# EAGLE design fb_in8_24VDC_3.2 (EAGLE 5.00)
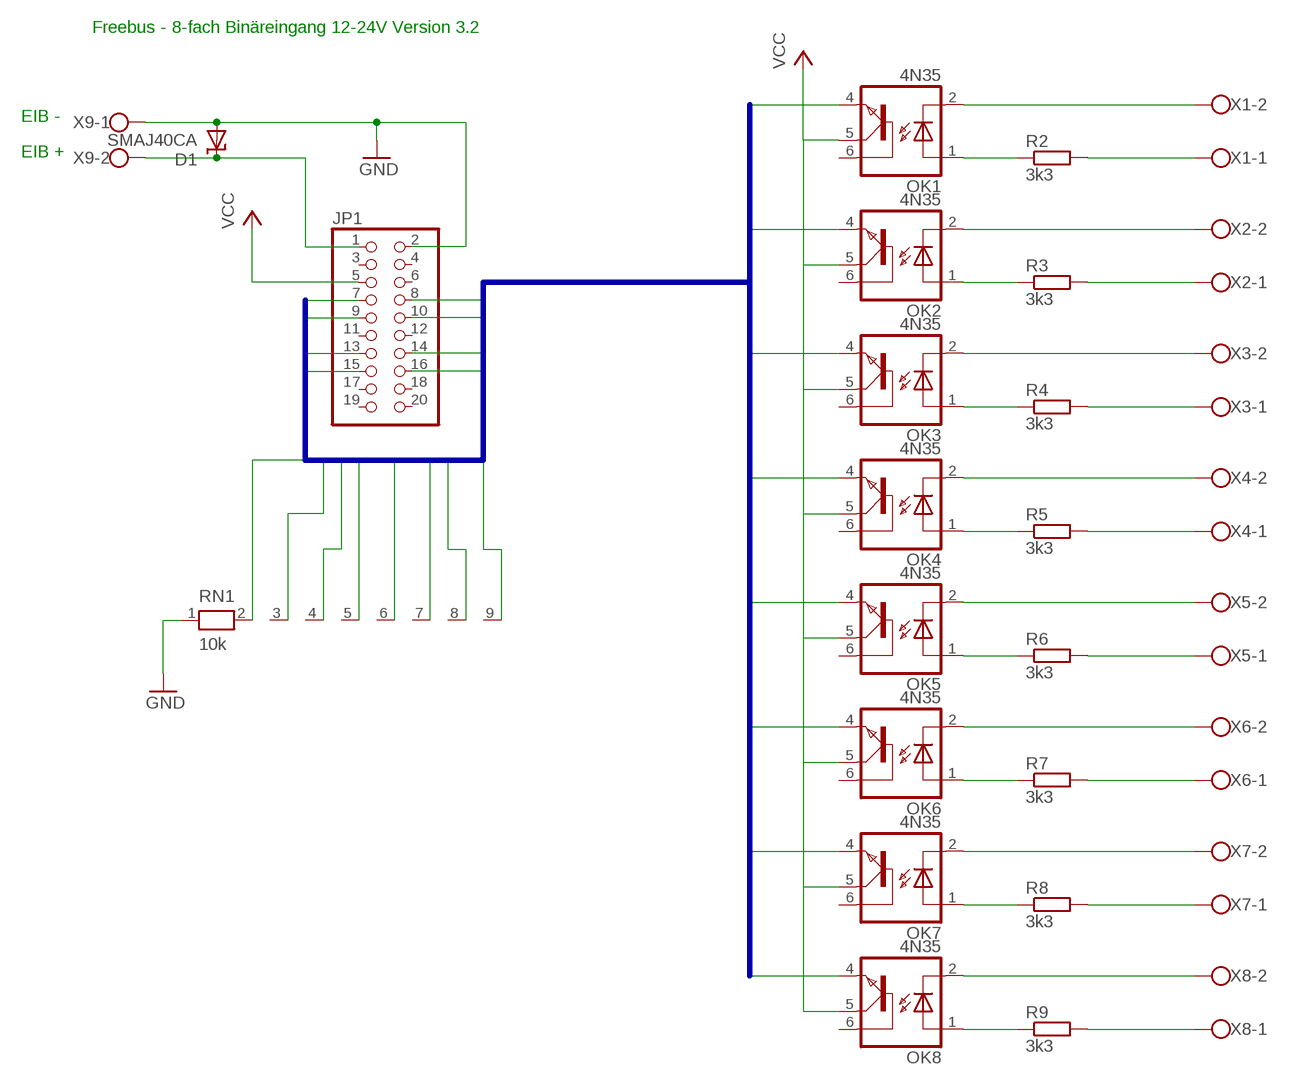
[diagram p0: schematic, sheet 1]

## Parts
D1  SMAJ40CA  SUPPRESSOR-SMBJ  [SMBJ]
JP1  PINHD-2X10  [2X10]
OK1  4N35  [DIL06]
OK2  4N35  [DIL06]
OK3  4N35  [DIL06]
OK4  4N35  [DIL06]
OK5  4N35  [DIL06]
OK6  4N35  [DIL06]
OK7  4N35  [DIL06]
OK8  4N35  [DIL06]
R2  3k3  R-EU_0207/10  [0207/10]
R3  3k3  R-EU_0207/10  [0207/10]
R4  3k3  R-EU_0207/10  [0207/10]
R5  3k3  R-EU_0207/10  [0207/10]
R6  3k3  R-EU_0207/10  [0207/10]
R7  3k3  R-EU_0207/10  [0207/10]
R8  3k3  R-EU_0207/10  [0207/10]
R9  3k3  R-EU_0207/10  [0207/10]
RN1  10k  RN08  [RN-9]
X1  W237-02P  [W237-132]
X2  W237-02P  [W237-132]
X3  W237-02P  [W237-132]
X4  W237-02P  [W237-132]
X5  W237-02P  [W237-132]
X6  W237-02P  [W237-132]
X7  W237-02P  [W237-132]
X8  W237-02P  [W237-132]
X9  W237-102  [W237-102]

## Nets
GND: D1.A JP1.2 RN1.1 X9.1
IO1: JP1.7 OK1.4(EMI) RN1.9
IO2: JP1.8 OK2.4(EMI) RN1.8
IO3: JP1.9 OK3.4(EMI) RN1.7
IO4: JP1.10 OK4.4(EMI) RN1.6
IO5: JP1.13 OK5.4(EMI) RN1.5
IO6: JP1.14 OK6.4(EMI) RN1.4
IO7: JP1.15 OK7.4(EMI) RN1.3
IO8: JP1.16 OK8.4(EMI) RN1.2
N$1: R8.2 X7.1
N$5: D1.C JP1.1 X9.2
N$25: OK2.2(C) X2.2
N$26: OK1.1(A) R2.1
N$27: OK2.1(A) R3.1
N$28: OK3.1(A) R4.1
N$29: OK4.1(A) R5.1
N$30: OK5.1(A) R6.1
N$31: OK6.1(A) R7.1
N$32: OK7.1(A) R8.1
N$33: OK8.1(A) R9.1
N$34: R3.2 X2.1
N$35: OK3.2(C) X3.2
N$36: R4.2 X3.1
N$37: OK4.2(C) X4.2
N$38: R5.2 X4.1
N$39: OK5.2(C) X5.2
N$40: R6.2 X5.1
N$41: OK1.2(C) X1.2
N$42: OK6.2(C) X6.2
N$43: R7.2 X6.1
N$44: OK7.2(C) X7.2
N$46: OK8.2(C) X8.2
N$47: R9.2 X8.1
N$48: R2.2 X1.1
VCC: JP1.5 OK1.5(COL) OK2.5(COL) OK3.5(COL) OK4.5(COL) OK5.5(COL) OK6.5(COL) OK7.5(COL) OK8.5(COL)
Unconnected: JP1.3 JP1.4 JP1.6 JP1.11 JP1.12 JP1.17 JP1.18 JP1.19 JP1.20 OK1.6(BAS) OK2.6(BAS) OK3.6(BAS) OK4.6(BAS) OK5.6(BAS) OK6.6(BAS) OK7.6(BAS) OK8.6(BAS)

## Buses
IO[1..8]

## Notes on the sheet
- Freebus - 8-fach Binäreingang 12-24V Version 3.2
- EIB -
- EIB +

## Library data of the parts
D1 = diode:SUPPRESSOR-: Suppressor diode
JP1 = pinhead:PINHD-2X10: PIN HEADER
OK1-OK8 = optocoupler:4N35: MOTOROLA OPTO COUPLER
R2-R9 = rcl:R-EU_: RESISTOR, European symbol
RN1 = resistor-net:RN08: RESISTOR NETWORK
X1-X8 = con-wago-508:W237-02P: WAGO SREW CLAMP
X9 = con-wago-500:W237-102: WAGO SCREW CLAMP

## Board
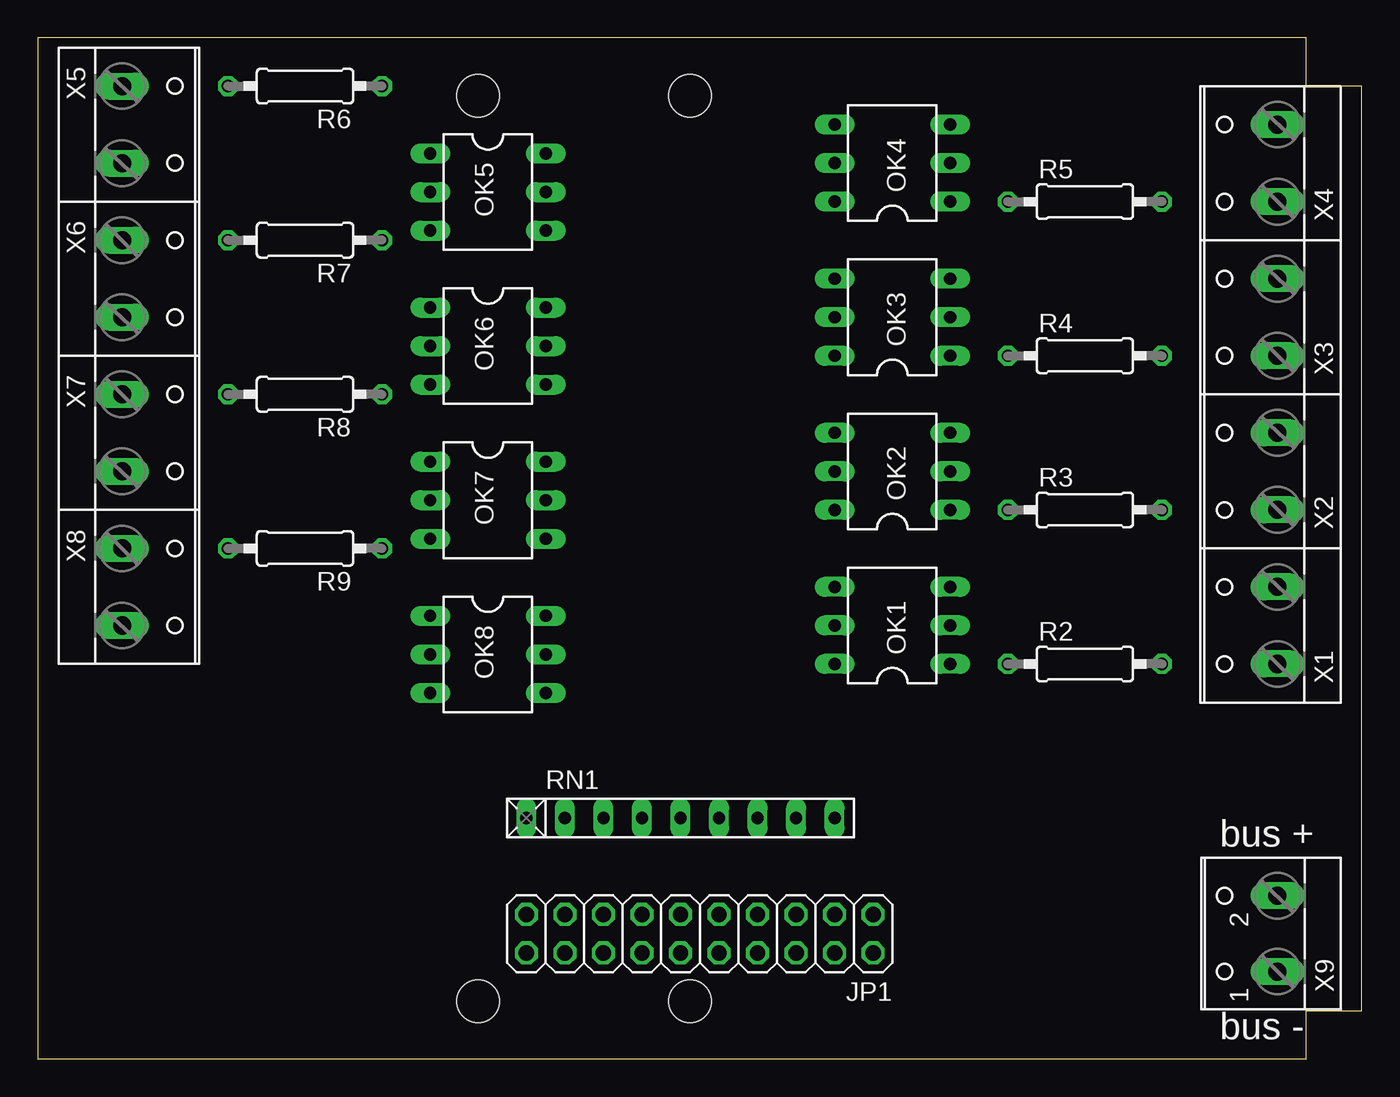
[diagram p1: board, top side]
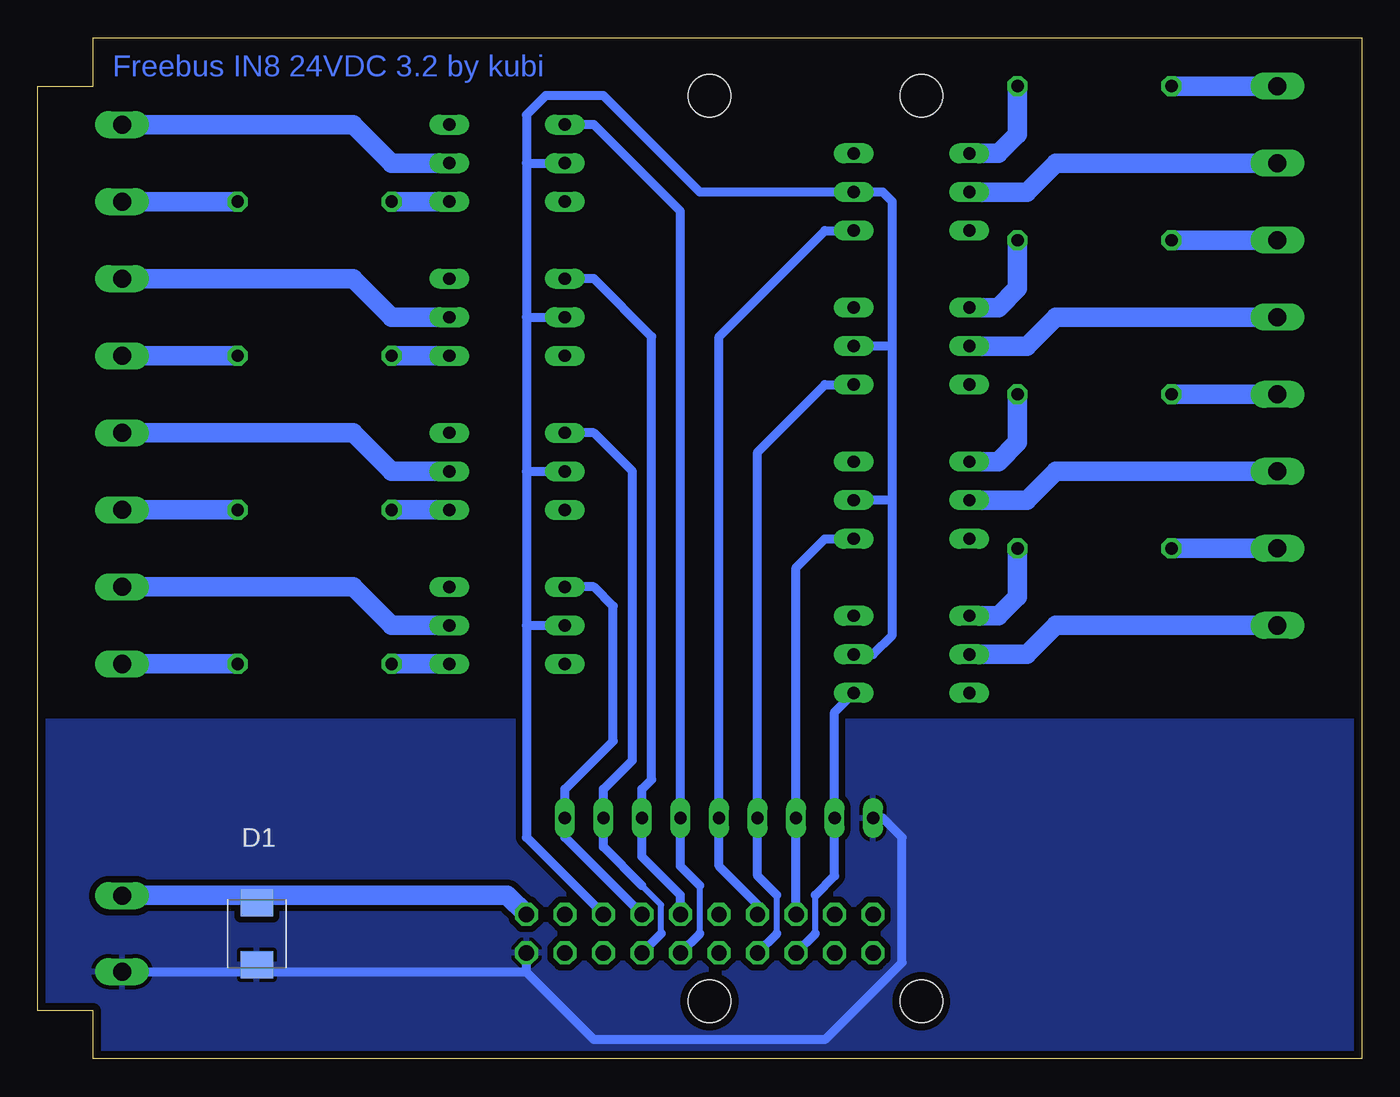
[diagram p2: board, bottom side, seen from below]

Size 87.3 x 67.31 mm. Coordinates in mm from the lower left corner, seen from the top.
Outline: 0,0.01 83.66,0 83.66,3.18 87.3,3.18 87.3,64.13 83.66,64.13 83.66,67.31 0,67.31 0,0.01
Copper layers (1*16): Top 0.035mm / dielectric 1.5mm / Bottom 0.035mm
Design rules "default *": minimum track width 10mil, minimum drill 24mil, track to track 16mil, track to pad 16mil, pad to pad 16mil, via to via 16mil, smd to smd 16mil, copper to edge 20mil, drill to drill 10mil, minimum pad ring 10mil, minimum via ring 8mil, stop-mask expansion 4mil, vias tented up to drill 0mil, thermal gap 10mil
Holes 2.8 mm at 43.02,63.5 29.04,3.81 29.04,63.5 43.02,3.81

### Footprints (pad centres in the part's own frame; a part is rotated, then mirrored left to right if it is on the bottom)
SMBJ = smd 1.78 x 2.16: A 2.04,0; C -2.03,0
2X10 = drill 1.016 octagon: 1 -11.43,-1.27; 2 -11.43,1.27; 3 -8.89,-1.27; 4 -8.89,1.27; 5 -6.35,-1.27; 6 -6.35,1.27; 7 -3.81,-1.27; 8 -3.81,1.27; 9 -1.27,-1.27; 10 -1.27,1.27; 11 1.27,-1.27; 12 1.27,1.27; 13 3.81,-1.27; 14 3.81,1.27; 15 6.35,-1.27; 16 6.35,1.27; 17 8.89,-1.27; 18 8.89,1.27; 19 11.43,-1.27; 20 11.43,1.27
DIL06 = drill 0.813 long: 1 -2.54,-3.81; 2 0,-3.81; 3 2.54,-3.81; 4 2.54,3.81; 5 0,3.81; 6 -2.54,3.81
0207/10 = drill 0.813 octagon: 1 -5.08,0; 2 5.08,0
RN-9 = drill 0.813 long: 1 -10.16,0; 2 -7.62,0; 3 -5.08,0; 4 -2.54,0; 5 0,0; 6 2.54,0; 7 5.08,0; 8 7.62,0; 9 10.16,0
W237-132 = drill 1.194 long: 1 -2.54,-0.635; 2 2.54,-0.635
W237-102 = drill 1.194 long: 1 -2.5,-1.27; 2 2.5,-1.27

### Placement (x,y rotation side)
D1  72.86,8.26 270 bottom
JP1  43.65,8.26 180 top
OK1  56.35,28.58 90 top
OK2  56.35,38.73 90 top
OK3  56.35,48.89 90 top
OK4  56.35,59.05 90 top
OK5  29.68,57.15 270 top
OK6  29.68,46.99 270 top
OK7  29.68,36.83 270 top
OK8  29.68,26.67 270 top
R2  69.05,26.04 0 top
R3  69.05,36.2 0 top
R4  69.05,46.35 0 top
R5  69.05,56.52 0 top
R6  17.61,64.14 180 top
R7  17.61,53.98 180 top
R8  17.61,43.81 180 top
R9  17.61,33.66 180 top
RN1  42.38,15.88 0 top
X1  81.11,28.58 90 top
X2  81.11,38.73 90 top
X3  81.11,48.89 90 top
X4  81.11,59.05 90 top
X5  6.18,61.59 270 top
X6  6.18,51.43 270 top
X7  6.18,41.27 270 top
X8  6.18,31.12 270 top
X9  80.48,8.26 90 top

### Tracks (layer width: path | path; a pad name or v marks a point on that pad's centre or on a via)
GND
  Bottom 0.406: X9.1 81.75,5.71
  Bottom 0.61: 55.08,5.71 JP1.2 | 55.08,5.71 80.48,5.71 X9.1 | RN1.1 31.58,15.88 30.31,14.61 30.31,6.35 35.39,1.27 50.63,1.27 55.08,5.71
  pour Bottom: 0.47,0.64 0.47,22.23 34.76,22.23 36.03,23.5 50,23.5 51.27,22.23 86.83,22.23 86.83,0.64
IO1
  Bottom 0.61: OK1.4 50.63,31.12 49.37,29.85 49.37,20.96 52.54,17.78 RN1.9 52.54,14.61 JP1.7
IO2
  Bottom 0.406: 46.19,8.26 46.19,10.16 47.46,11.43
  Bottom 0.61: JP1.8 46.19,8.26 | OK2.4 50.63,41.27 48.09,38.73 48.09,19.69 50,17.78 RN1.8 50,13.97 47.46,11.43
IO3
  Bottom 0.61: OK3.4 50.63,51.43 46.82,47.62 46.82,18.42 47.46,17.78 RN1.7 47.46,13.33 44.92,10.79 JP1.9
IO4
  Bottom 0.406: 43.65,8.26 43.65,11.43
  Bottom 0.61: JP1.10 43.65,8.26 | OK4.4 50.63,61.59 44.92,55.88 RN1.6 44.92,12.7 43.65,11.43
IO5
  Bottom 0.61: OK5.4 35.39,54.61 42.38,47.62 RN1.5 42.38,12.7 39.84,10.16 JP1.13
IO6
  Bottom 0.406: 38.57,8.26 38.57,10.79
  Bottom 0.61: JP1.14 38.57,8.26 | OK6.4 35.39,44.45 39.84,40 RN1.4 39.84,12.06 38.57,10.79
IO7
  Bottom 0.61: OK7.4 35.39,34.29 37.3,32.38 RN1.3 JP1.15
IO8
  Bottom 0.406: 36.03,8.26 36.03,10.79
  Bottom 0.61: JP1.16 36.03,8.26 | OK8.4 34.76,22.86 RN1.2 34.76,12.06 36.03,10.79
N$1
  Bottom 1.27: X7.1 R8.2
N$5
  Bottom 0.406: 72.86,10.16 D1.C 72.86,10.79
  Bottom 1.27: JP1.1 56.35,10.79 72.86,10.79 80.48,10.79 X9.2
N$25
  Bottom 1.27: OK2.2 63.97,38.73 66.51,41.27 X2.2
N$26
  Bottom 1.27: OK1.1 R2.1
N$27
  Bottom 1.27: OK2.1 R3.1
N$28
  Bottom 1.27: OK3.1 R4.1
N$29
  Bottom 1.27: OK4.1 R5.1
N$30
  Bottom 1.27: R6.1 22.7,60.96 23.96,59.69 OK5.1
N$31
  Bottom 1.27: R7.1 22.7,50.8 23.96,49.53 OK6.1
N$32
  Bottom 1.27: R8.1 22.7,40.64 23.96,39.37 OK7.1
N$33
  Bottom 1.27: R9.1 22.7,30.48 23.96,29.21 OK8.1
N$34
  Bottom 1.27: R3.2 X2.1
N$35
  Bottom 1.27: OK3.2 63.97,48.89 66.51,51.43 X3.2
N$36
  Bottom 1.27: R4.2 X3.1
N$37
  Bottom 1.27: OK4.2 63.97,59.05 66.51,61.59 X4.2
N$38
  Bottom 1.27: R5.2 X4.1
N$39
  Bottom 1.27: OK5.2 22.06,57.15 20.15,59.05 X5.2
N$40
  Bottom 1.27: X5.1 R6.2
N$41
  Bottom 1.27: OK1.2 63.97,28.58 66.51,31.12 X1.2
N$42
  Bottom 1.27: OK6.2 22.06,46.99 20.15,48.89 X6.2
N$43
  Bottom 1.27: X6.1 R7.2
N$44
  Bottom 1.27: OK7.2 22.06,36.83 20.15,38.73 X7.2
N$46
  Bottom 1.27: OK8.2 22.06,26.67 20.15,28.58 X8.2
N$47
  Bottom 1.27: X8.1 R9.2
N$48
  Bottom 1.27: R2.2 X1.1
VCC
  Bottom 0.61: OK8.5 32.22,26.67 30.95,27.94 30.95,36.83 | 30.95,36.83 OK7.5 | 30.95,36.83 30.95,46.99 | 30.95,46.99 OK6.5 | 30.95,46.99 30.95,56.52 31.58,57.15 OK5.5 43.65,57.15 50,63.5 53.81,63.5 55.08,62.23 55.08,59.05 | 55.08,59.05 OK4.5 | 55.08,59.05 55.08,48.89 | 55.08,48.89 OK3.5 | 55.08,48.89 55.08,38.73 | 55.08,38.73 OK2.5 | 55.08,38.73 55.08,28.58 | 55.08,28.58 OK1.5 | 55.08,28.58 55.08,14.61 JP1.5

### Text on the board
Bottom: Freebus IN8 24VDC 3.2 by kubi
tPlace: bus + | bus -